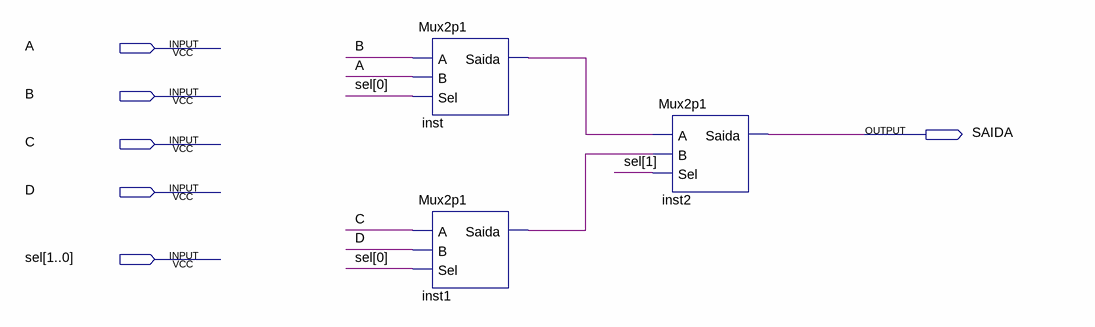
[diagram p0: schematic sheet]
// Quartus schematic MUX_1bit_4p1.bdf as structural Verilog: 3 symbols, 6 pins
module MUX_1bit_4p1 (
  input  A,
  input  B,
  input  C,
  input  D,
  input  [1:0] sel,
  output SAIDA
);

  wire inst1_saida, inst_saida;

  Mux2p1 inst (.A(B), .B(A), .Sel(sel[0]), .Saida(inst_saida));
  Mux2p1 inst1 (.A(C), .B(D), .Sel(sel[0]), .Saida(inst1_saida));
  Mux2p1 inst2 (.A(inst_saida), .B(inst1_saida), .Sel(sel[1]), .Saida(SAIDA));
endmodule
